# Altium project IMU_BMI085.PrjPcb
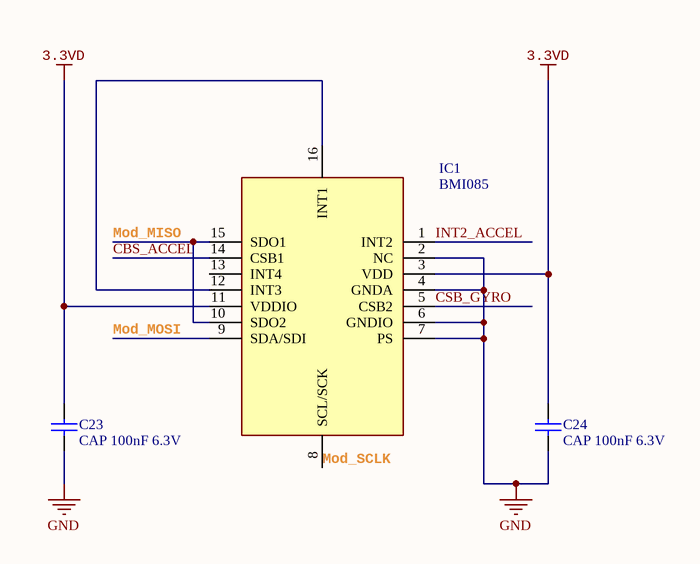
[diagram p0: IMU_BMI085.SchDoc]
1 sheet, 3 parts. Net scope: global (net labels, ports and power ports of the same name join across sheets).

## Sheet IMU_BMI085.SchDoc
size A4

### Parts
C23  CAP 100nF 6.3V  [CAPC0603(1608)100_N]
C24  CAP 100nF 6.3V  [CAPC0603(1608)100_N]
IC1  BMI085  [BMI085]

### Nets
3.3VD: C23.2 C24.2 IC1.3(VDD) IC1.11(VDDIO)
GND: C23.1 C24.1 IC1.2(NC) IC1.4(GNDA) IC1.6(GNDIO) IC1.7(PS)
CBS_ACCEL: IC1.14(CSB1)
CSB_GYRO: IC1.5(CSB2)
INT2_ACCEL: IC1.1(INT2)
Mod_MISO: IC1.10(SDO2) IC1.15(SDO1)
Mod_MOSI: IC1.9(SDA/SDI)
Mod_SCLK: IC1.8(SCL/SCK)
NetIC1_12: IC1.12(INT3) IC1.16(INT1)

Not connected (* = marked no-connect by the designer): IC1 13(INT4)

### Library data of the parts
C23 C24 = CMP-1035-02576-1: CAP 100nF 6.3V ±10% 0603 (1608 Metric) Thickness 1mm SMD; Tolerance: Â±10%; Case-Metric: 1608; Case-EIA: 0603; Max Thickness: 1 mm; Value: 100nF; Rated Voltage: 6.3 V; Technology: SMT
IC1 = BMI085: Integrated Circuit; Manufacturer_Name: Bosch Sensortec; Datasheet Link: https://ae-bst.resource.bosch.com/media/_tech/media/datasheets/BST-BMI085-DS001.pdf; Height: 1mm; Manufacturer_Part_Number: BMI085; Mouser Part Number: 262-BMI085; Mouser Price/Stock: https://www.mouser.co.uk/ProductDetail/Bosch-Sensortec/BMI085?qs=y6ZabgHbY%252ByGCM8LfWZyqA%3D%3D; Arrow Part Number: BMI085; Arrow Price/Stock: https://www.arrow.com/en/products/bmi085/bosch